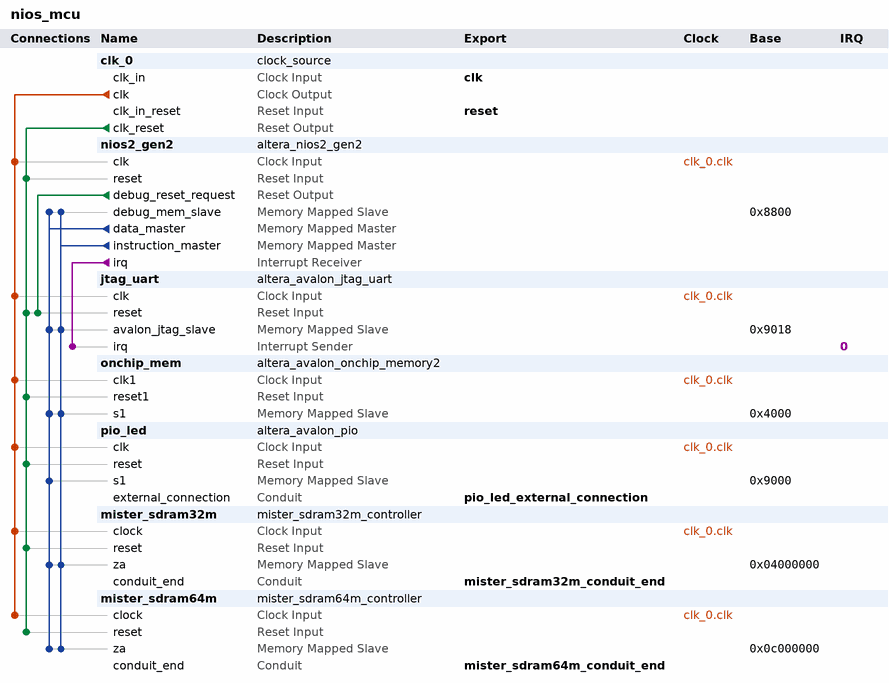
[diagram p0: system contents]
# Platform Designer (Qsys) system nios_mcu, Cyclone V 5CSEBA6U23I7
# Parameters at their usual value, and those the tool derives, are not listed.
package require -exact qsys 18.1
create_system nios_mcu
set_project_property DEVICE_FAMILY {Cyclone V}
set_project_property DEVICE 5CSEBA6U23I7

add_instance clk_0 clock_source 18.1
set_instance_parameter_value clk_0 clockFrequency 50000000

add_instance nios2_gen2 altera_nios2_gen2 18.1
set_instance_parameter_value nios2_gen2 dcache_size 2048
set_instance_parameter_value nios2_gen2 exceptionSlave onchip_mem.s1
set_instance_parameter_value nios2_gen2 icache_size 4096
set_instance_parameter_value nios2_gen2 impl Tiny
set_instance_parameter_value nios2_gen2 resetSlave onchip_mem.s1

add_instance jtag_uart altera_avalon_jtag_uart 18.1
set_instance_parameter_value jtag_uart simInteractiveOptions NO_INTERACTIVE_WINDOWS

add_instance onchip_mem altera_avalon_onchip_memory2 18.1
set_instance_parameter_value onchip_mem dataWidth 32
set_instance_parameter_value onchip_mem dualPort false
set_instance_parameter_value onchip_mem initMemContent true
set_instance_parameter_value onchip_mem initializationFileName onchip_mem.hex
set_instance_parameter_value onchip_mem memorySize 10240

add_instance pio_led altera_avalon_pio 18.1
set_instance_parameter_value pio_led direction Output
set_instance_parameter_value pio_led width 8

add_instance mister_sdram32m mister_sdram32m_controller 1.0

add_instance mister_sdram64m mister_sdram64m_controller 1.0

# connections
add_connection clk_0.clk jtag_uart.clk clock
add_connection clk_0.clk mister_sdram32m.clock clock
add_connection clk_0.clk mister_sdram64m.clock clock
add_connection clk_0.clk nios2_gen2.clk clock
add_connection clk_0.clk onchip_mem.clk1 clock
add_connection clk_0.clk pio_led.clk clock
add_connection clk_0.clk_reset jtag_uart.reset reset
add_connection clk_0.clk_reset mister_sdram32m.reset reset
add_connection clk_0.clk_reset mister_sdram64m.reset reset
add_connection clk_0.clk_reset nios2_gen2.reset reset
add_connection clk_0.clk_reset onchip_mem.reset1 reset
add_connection clk_0.clk_reset pio_led.reset reset
add_connection nios2_gen2.debug_reset_request jtag_uart.reset reset
add_connection nios2_gen2.data_master jtag_uart.avalon_jtag_slave avalon
set_connection_parameter_value nios2_gen2.data_master/jtag_uart.avalon_jtag_slave baseAddress 0x9018
add_connection nios2_gen2.data_master mister_sdram32m.za avalon
set_connection_parameter_value nios2_gen2.data_master/mister_sdram32m.za baseAddress 0x04000000
add_connection nios2_gen2.data_master mister_sdram64m.za avalon
set_connection_parameter_value nios2_gen2.data_master/mister_sdram64m.za baseAddress 0x0c000000
add_connection nios2_gen2.data_master nios2_gen2.debug_mem_slave avalon
set_connection_parameter_value nios2_gen2.data_master/nios2_gen2.debug_mem_slave baseAddress 0x8800
add_connection nios2_gen2.data_master onchip_mem.s1 avalon
set_connection_parameter_value nios2_gen2.data_master/onchip_mem.s1 baseAddress 0x4000
add_connection nios2_gen2.data_master pio_led.s1 avalon
set_connection_parameter_value nios2_gen2.data_master/pio_led.s1 baseAddress 0x9000
add_connection nios2_gen2.instruction_master jtag_uart.avalon_jtag_slave avalon
set_connection_parameter_value nios2_gen2.instruction_master/jtag_uart.avalon_jtag_slave baseAddress 0x9018
add_connection nios2_gen2.instruction_master mister_sdram32m.za avalon
set_connection_parameter_value nios2_gen2.instruction_master/mister_sdram32m.za baseAddress 0x04000000
add_connection nios2_gen2.instruction_master mister_sdram64m.za avalon
set_connection_parameter_value nios2_gen2.instruction_master/mister_sdram64m.za baseAddress 0x0c000000
add_connection nios2_gen2.instruction_master nios2_gen2.debug_mem_slave avalon
set_connection_parameter_value nios2_gen2.instruction_master/nios2_gen2.debug_mem_slave baseAddress 0x8800
add_connection nios2_gen2.instruction_master onchip_mem.s1 avalon
set_connection_parameter_value nios2_gen2.instruction_master/onchip_mem.s1 baseAddress 0x4000
add_connection nios2_gen2.irq jtag_uart.irq interrupt
set_connection_parameter_value nios2_gen2.irq/jtag_uart.irq irqNumber 0

# exported interfaces
add_interface clk clock sink
set_interface_property clk EXPORT_OF clk_0.clk_in
add_interface mister_sdram32m_conduit_end conduit end
set_interface_property mister_sdram32m_conduit_end EXPORT_OF mister_sdram32m.conduit_end
add_interface mister_sdram64m_conduit_end conduit end
set_interface_property mister_sdram64m_conduit_end EXPORT_OF mister_sdram64m.conduit_end
add_interface pio_led_external_connection conduit end
set_interface_property pio_led_external_connection EXPORT_OF pio_led.external_connection
add_interface reset reset sink
set_interface_property reset EXPORT_OF clk_0.clk_in_reset

set_interconnect_requirement {$system} qsys_mm.clockCrossingAdapter HANDSHAKE
set_interconnect_requirement {$system} qsys_mm.enableEccProtection FALSE
set_interconnect_requirement {$system} qsys_mm.insertDefaultSlave FALSE
set_interconnect_requirement {$system} qsys_mm.maxAdditionalLatency 1

save_system nios_mcu.qsys
